# Altium schematic sheet FPGA_XC6SLX9.SchDoc: FPGA XC6SLX9
size A3
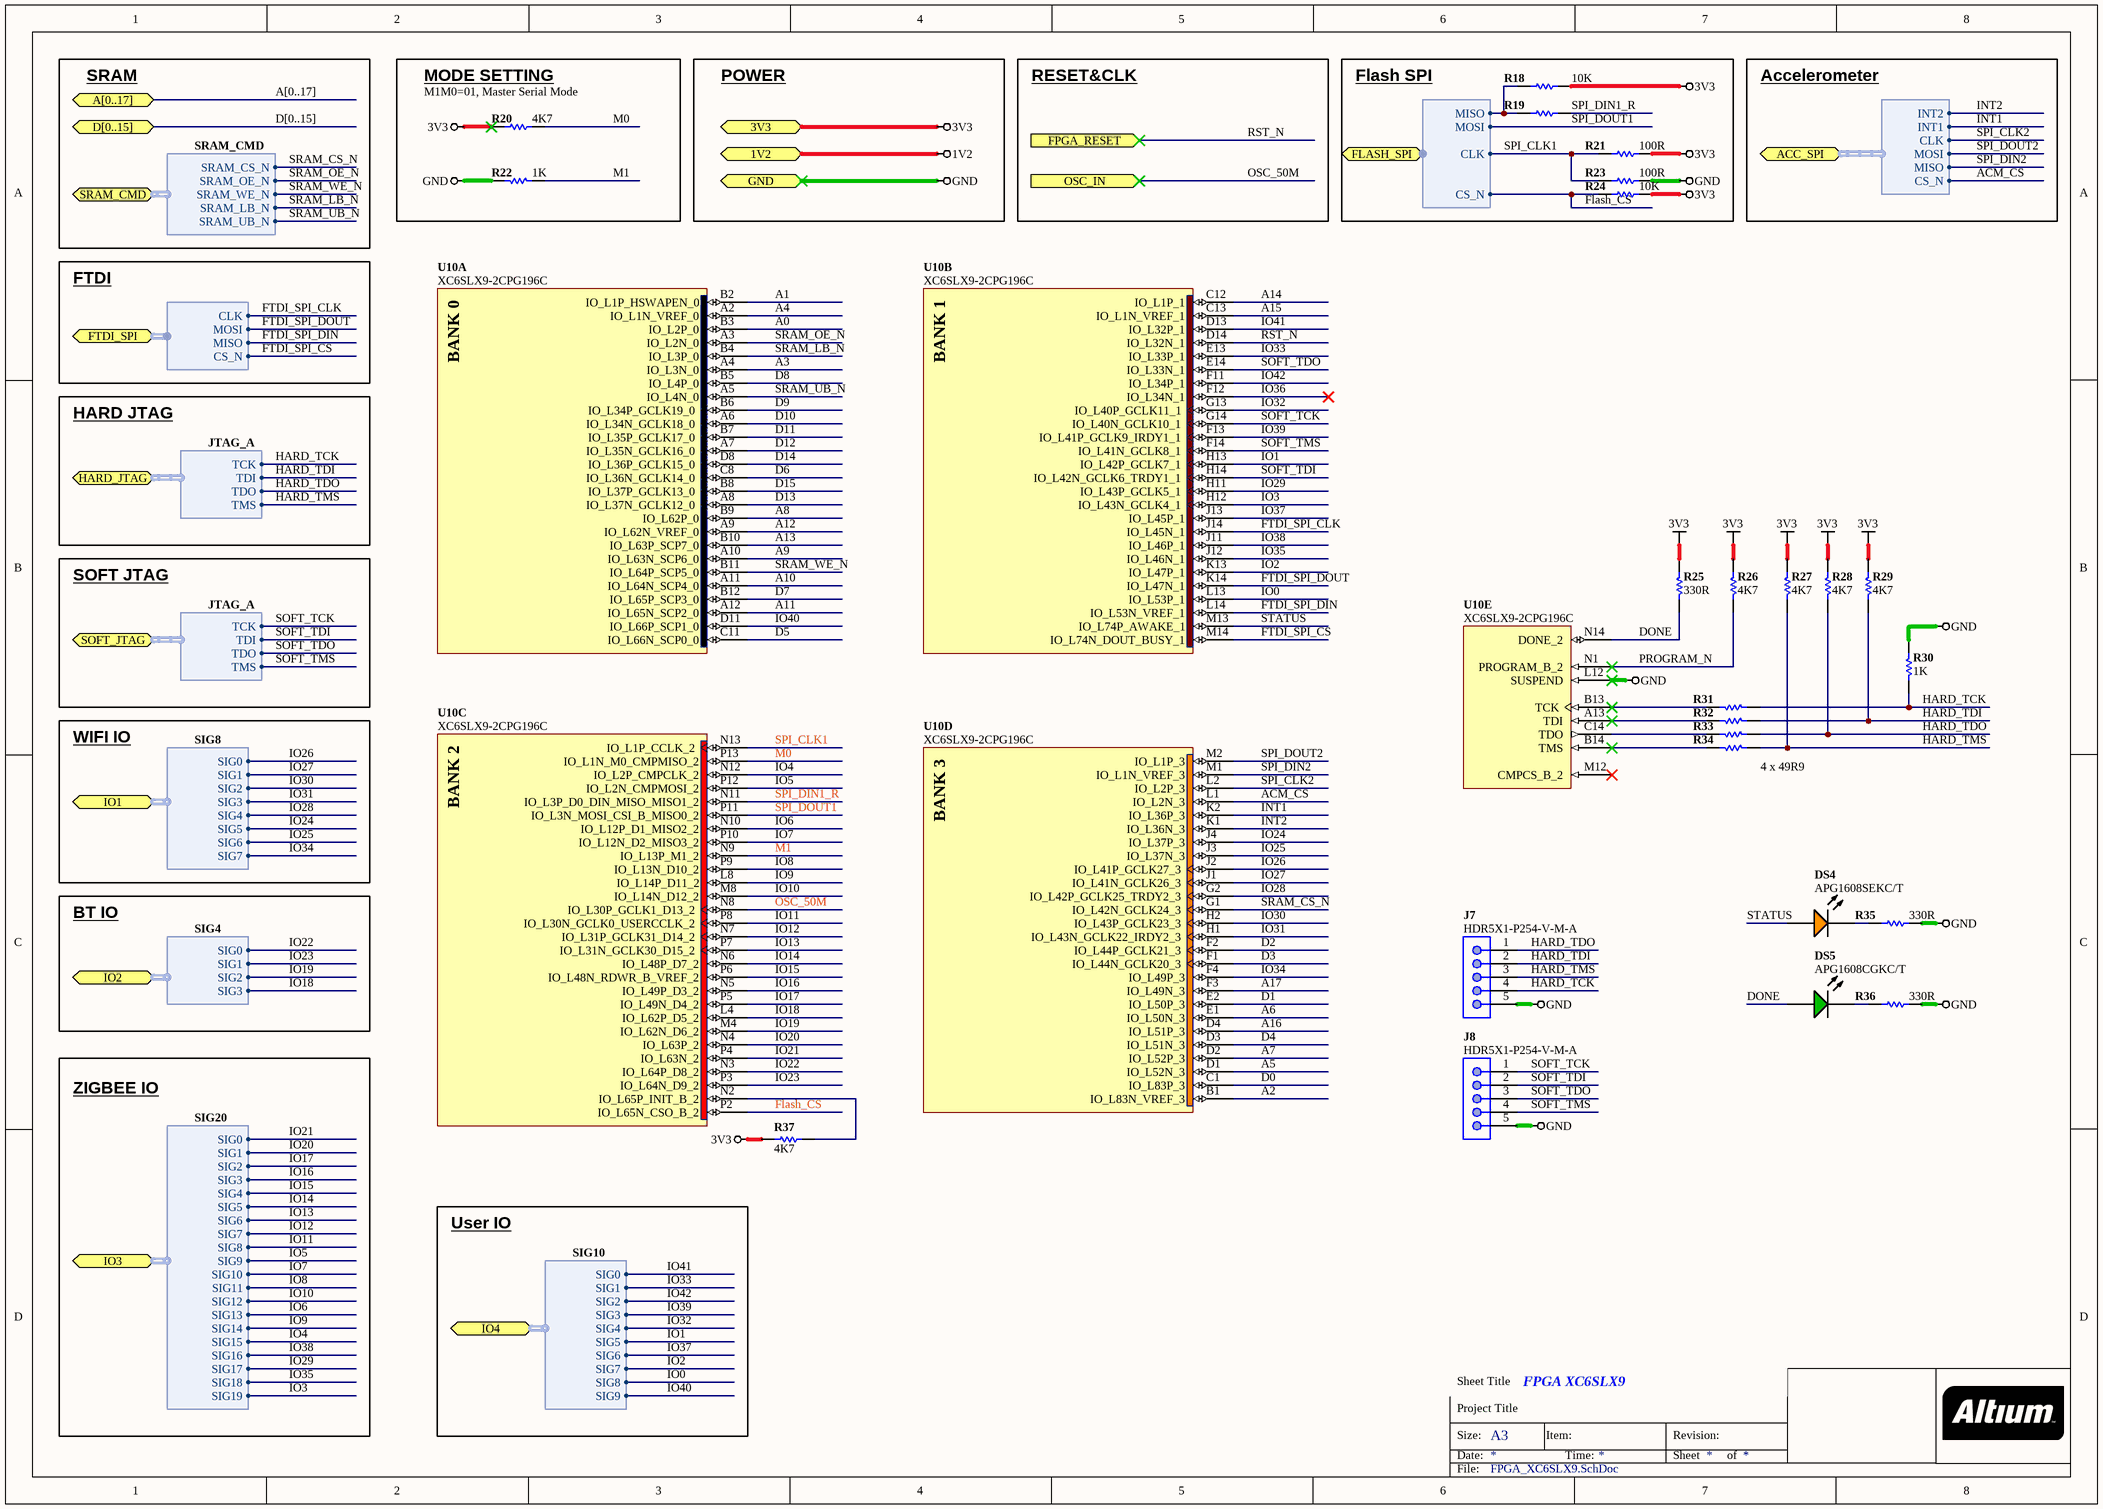
[diagram p0: FPGA_XC6SLX9.SchDoc]

## Parts
DS4  APG1608SEKC/T  [KING-0603(1608)25-Orange]
DS5  APG1608CGKC/T  [KING-0603(1608)25-Green]
J7  HDR5X1-P254-V-M-A  [HDR5X1-P254-V-M-A]
J8  HDR5X1-P254-V-M-A  [HDR5X1-P254-V-M-A]
R18  10K  [RESC0402(1005)_N]
R19  49R9  [RESC0402(1005)_N]  (value not drawn)
R20  4K7  [RESC0402(1005)_N]
R21  100R  [RESC0402(1005)_N]
R22  1K  [RESC0402(1005)_N]
R23  100R  [RESC0402(1005)_N]
R24  10K  [RESC0402(1005)_N]
R25  330R  [RESC0402(1005)_N]
R26  4K7  [RESC0402(1005)_N]
R27  4K7  [RESC0402(1005)_N]
R28  4K7  [RESC0402(1005)_N]
R29  4K7  [RESC0402(1005)_N]
R30  1K  [RESC0402(1005)_N]
R31  49R9  [RESC0402(1005)_N]  (value not drawn)
R32  49R9  [RESC0402(1005)_N]  (value not drawn)
R33  49R9  [RESC0402(1005)_N]  (value not drawn)
R34  49R9  [RESC0402(1005)_N]  (value not drawn)
R35  330R  [RESC0402(1005)_N]
R36  330R  [RESC0402(1005)_N]
R37  4K7  [RESC0402(1005)_N]
U10  XC6SLX9-2CPG196C  [CPG196]  (parts A,B,C,D,E of 7)

## Blocks framed on the sheet
MODE SETTING: R20 R22
Flash SPI: R18 R19 R21 R23 R24

## Ports
1V2, 3V3, A[0..17] (bidir), ACC_SPI (harness ACC_SPI), D[0..15] (bidir), FLASH_SPI (harness FLASH_SPI), FPGA_RESET (in), FTDI_SPI (harness FTDI_SPI), GND, HARD_JTAG (harness JTAG_A), IO1 (harness SIG8), IO2 (harness SIG4), IO3 (harness SIG20), IO4 (harness SIG10), OSC_IN (in), SOFT_JTAG (harness JTAG_A), SRAM_CMD (harness SRAM_CMD)

## Harnesses
SRAM_CMD: SRAM_OE_N, SRAM_WE_N, SRAM_LB_N, SRAM_UB_N, SRAM_CS_N
SIG8: SIG0, SIG1, SIG2, SIG3, SIG4, SIG5, SIG6, SIG7
SIG4: SIG0, SIG1, SIG2, SIG3
SIG20: SIG0, SIG1, SIG2, SIG3, SIG4, SIG5, SIG6, SIG7, SIG8, SIG9, SIG10, SIG11, SIG12, SIG13, SIG14, SIG15, SIG16, SIG17, SIG18, SIG19
JTAG_A: TMS, TDO, TDI, TCK
SIG10: SIG0, SIG1, SIG2, SIG3, SIG4, SIG5, SIG6, SIG7, SIG8, SIG9
FTDI_SPI: CLK, CS_N, MOSI, MISO
ACC_SPI: CLK, CS_N, MOSI, MISO, INT1, INT2
FLASH_SPI: CLK, MOSI, MISO, CS_N

## Nets
1V2: port 1V2
3V3: R18.1 R20.2 R21.2 R24.2 R25.1 R26.2 R27.2 R28.2 R29.2 R37.2 ; port 3V3
GND: J7.5 J8.5 R22.2 R23.1 R30.2 R35.2 R36.2 U10.L12(SUSPEND) ; port GND
A0: U10.B3(IO_L2P_0)
A1: U10.B2(IO_L1P_HSWAPEN_0)
A2: U10.B1(IO_L83N_VREF_3)
A3: U10.A4(IO_L3N_0)
A4: U10.A2(IO_L1N_VREF_0)
A5: U10.D1(IO_L52N_3)
A6: U10.E1(IO_L50N_3)
A7: U10.D2(IO_L52P_3)
A8: U10.B9(IO_L62P_0)
A9: U10.A10(IO_L63N_SCP6_0)
A10: U10.A11(IO_L64N_SCP4_0)
A11: U10.A12(IO_L65N_SCP2_0)
A12: U10.A9(IO_L62N_VREF_0)
A13: U10.B10(IO_L63P_SCP7_0)
A14: U10.C12(IO_L1P_1)
A15: U10.C13(IO_L1N_VREF_1)
A16: U10.D4(IO_L51P_3)
A17: U10.F3(IO_L49N_3)
ACM_CS: U10.L1(IO_L2N_3) ; port ACC_SPI.CS_N
D0: U10.C1(IO_L83P_3)
D1: U10.E2(IO_L50P_3)
D2: U10.F2(IO_L44P_GCLK21_3)
D3: U10.F1(IO_L44N_GCLK20_3)
D4: U10.D3(IO_L51N_3)
D5: U10.C11(IO_L66N_SCP0_0)
D6: U10.C8(IO_L36N_GCLK14_0)
D7: U10.B12(IO_L65P_SCP3_0)
D8: U10.B5(IO_L4P_0)
D9: U10.B6(IO_L34P_GCLK19_0)
D10: U10.A6(IO_L34N_GCLK18_0)
D11: U10.B7(IO_L35P_GCLK17_0)
D12: U10.A7(IO_L35N_GCLK16_0)
D13: U10.A8(IO_L37N_GCLK12_0)
D14: U10.D8(IO_L36P_GCLK15_0)
D15: U10.B8(IO_L37P_GCLK13_0)
DONE: DS5.1(A) R25.2 U10.N14(DONE_2)
Flash_CS: R24.1 U10.P2(IO_L65N_CSO_B_2) ; port FLASH_SPI.CS_N
FTDI_SPI_CLK: U10.J14(IO_L45N_1) ; port FTDI_SPI.CLK
FTDI_SPI_CS: U10.M14(IO_L74N_DOUT_BUSY_1) ; port FTDI_SPI.CS_N
FTDI_SPI_DIN: U10.L14(IO_L53N_VREF_1) ; port FTDI_SPI.MISO
FTDI_SPI_DOUT: U10.K14(IO_L47N_1) ; port FTDI_SPI.MOSI
HARD_TCK: J7.4 R30.1 R31.1 ; port HARD_JTAG.TCK
HARD_TDI: J7.2 R29.1 R32.1 ; port HARD_JTAG.TDI
HARD_TDO: J7.1 R28.1 R33.1 ; port HARD_JTAG.TDO
HARD_TMS: J7.3 R27.1 R34.1 ; port HARD_JTAG.TMS
INT1: U10.K2(IO_L36P_3) ; port ACC_SPI.INT1
INT2: U10.K1(IO_L36N_3) ; port ACC_SPI.INT2
IO0: U10.L13(IO_L53P_1) ; port IO4.SIG8
IO1: U10.H13(IO_L42P_GCLK7_1) ; port IO4.SIG5
IO2: U10.K13(IO_L47P_1) ; port IO4.SIG7
IO3: U10.H12(IO_L43N_GCLK4_1) ; port IO3.SIG19
IO4: U10.N12(IO_L2P_CMPCLK_2) ; port IO3.SIG15
IO5: U10.P12(IO_L2N_CMPMOSI_2) ; port IO3.SIG9
IO6: U10.N10(IO_L12P_D1_MISO2_2) ; port IO3.SIG13
IO7: U10.P10(IO_L12N_D2_MISO3_2) ; port IO3.SIG10
IO8: U10.P9(IO_L13N_D10_2) ; port IO3.SIG11
IO9: U10.L8(IO_L14P_D11_2) ; port IO3.SIG14
IO10: U10.M8(IO_L14N_D12_2) ; port IO3.SIG12
IO11: U10.P8(IO_L30N_GCLK0_USERCCLK_2) ; port IO3.SIG8
IO12: U10.N7(IO_L31P_GCLK31_D14_2) ; port IO3.SIG7
IO13: U10.P7(IO_L31N_GCLK30_D15_2) ; port IO3.SIG6
IO14: U10.N6(IO_L48P_D7_2) ; port IO3.SIG5
IO15: U10.P6(IO_L48N_RDWR_B_VREF_2) ; port IO3.SIG4
IO16: U10.N5(IO_L49P_D3_2) ; port IO3.SIG3
IO17: U10.P5(IO_L49N_D4_2) ; port IO3.SIG2
IO18: U10.L4(IO_L62P_D5_2) ; port IO2.SIG3
IO19: U10.M4(IO_L62N_D6_2) ; port IO2.SIG2
IO20: U10.N4(IO_L63P_2) ; port IO3.SIG1
IO21: U10.P4(IO_L63N_2) ; port IO3.SIG0
IO22: U10.N3(IO_L64P_D8_2) ; port IO2.SIG0
IO23: U10.P3(IO_L64N_D9_2) ; port IO2.SIG1
IO24: U10.J4(IO_L37P_3) ; port IO1.SIG5
IO25: U10.J3(IO_L37N_3) ; port IO1.SIG6
IO26: U10.J2(IO_L41P_GCLK27_3) ; port IO1.SIG0
IO27: U10.J1(IO_L41N_GCLK26_3) ; port IO1.SIG1
IO28: U10.G2(IO_L42P_GCLK25_TRDY2_3) ; port IO1.SIG4
IO29: U10.H11(IO_L43P_GCLK5_1) ; port IO3.SIG17
IO30: U10.H2(IO_L43P_GCLK23_3) ; port IO1.SIG2
IO31: U10.H1(IO_L43N_GCLK22_IRDY2_3) ; port IO1.SIG3
IO32: U10.G13(IO_L40P_GCLK11_1) ; port IO4.SIG4
IO33: U10.E13(IO_L33P_1) ; port IO4.SIG1
IO34: U10.F4(IO_L49P_3) ; port IO1.SIG7
IO35: U10.J12(IO_L46N_1) ; port IO3.SIG18
IO36: U10.F12(IO_L34N_1)
IO37: U10.J13(IO_L45P_1) ; port IO4.SIG6
IO38: U10.J11(IO_L46P_1) ; port IO3.SIG16
IO39: U10.F13(IO_L41P_GCLK9_IRDY1_1) ; port IO4.SIG3
IO40: U10.D11(IO_L66P_SCP1_0) ; port IO4.SIG9
IO41: U10.D13(IO_L32P_1) ; port IO4.SIG0
IO42: U10.F11(IO_L34P_1) ; port IO4.SIG2
M0: R20.1 U10.P13(IO_L1N_M0_CMPMISO_2)
M1: R22.1 U10.N9(IO_L13P_M1_2)
OSC_50M: U10.N8(IO_L30P_GCLK1_D13_2) ; port OSC_IN
PROGRAM_N: R26.1 U10.N1(PROGRAM_B_2)
RST_N: U10.D14(IO_L32N_1) ; port FPGA_RESET
SOFT_TCK: J8.1 U10.G14(IO_L40N_GCLK10_1) ; port SOFT_JTAG.TCK
SOFT_TDI: J8.2 U10.H14(IO_L42N_GCLK6_TRDY1_1) ; port SOFT_JTAG.TDI
SOFT_TDO: J8.3 U10.E14(IO_L33N_1) ; port SOFT_JTAG.TDO
SOFT_TMS: J8.4 U10.F14(IO_L41N_GCLK8_1) ; port SOFT_JTAG.TMS
SPI_CLK1: R21.1 R23.2 U10.N13(IO_L1P_CCLK_2) ; port FLASH_SPI.CLK
SPI_CLK2: U10.L2(IO_L2P_3) ; port ACC_SPI.CLK
SPI_DIN1_R: R19.2 U10.N11(IO_L3P_D0_DIN_MISO_MISO1_2)
SPI_DIN2: U10.M1(IO_L1N_VREF_3) ; port ACC_SPI.MISO
SPI_DOUT1: U10.P11(IO_L3N_MOSI_CSI_B_MISO0_2) ; port FLASH_SPI.MOSI
SPI_DOUT2: U10.M2(IO_L1P_3) ; port ACC_SPI.MOSI
SRAM_CS_N: U10.G1(IO_L42N_GCLK24_3) ; port SRAM_CMD.SRAM_CS_N
SRAM_LB_N: U10.B4(IO_L3P_0) ; port SRAM_CMD.SRAM_LB_N
SRAM_OE_N: U10.A3(IO_L2N_0) ; port SRAM_CMD.SRAM_OE_N
SRAM_UB_N: U10.A5(IO_L4N_0) ; port SRAM_CMD.SRAM_UB_N
SRAM_WE_N: U10.B11(IO_L64P_SCP5_0) ; port SRAM_CMD.SRAM_WE_N
STATUS: DS4.1(A) U10.M13(IO_L74P_AWAKE_1)
NetDS4_2: DS4.2(K) R35.1
NetDS5_2: DS5.2(K) R36.1
NetR18_2: R18.2 R19.1 ; port FLASH_SPI.MISO
NetR31_2: R31.2 U10.B13(TCK)
NetR32_2: R32.2 U10.A13(TDI)
NetR33_2: R33.2 U10.C14(TDO)
NetR34_2: R34.2 U10.B14(TMS)
NetR37_1: R37.1 U10.N2(IO_L65P_INIT_B_2)

Not connected (* = marked no-connect by the designer): U10 M12(CMPCS_B_2)*

## Buses and harness runs
bus A[0..17] = port A[0..17]
bus D[0..15] = port D[0..15]

## Notes on the sheet
- SRAM
- (near R20) M1M0=01, Master Serial Mode
- POWER
- RESET&CLK
- Accelerometer
- FTDI
- HARD JTAG
- SOFT JTAG
- WIFI IO
- (near R34) 4 x 49R9
- BT IO
- ZIGBEE IO
- User IO
- Sheet Title
- Project Title
- Size:
- Date:
- A3
- Item:
- Time:
- Revision:
- Sheet
- of
- File:
- (in symbol CMP-0067-00328-1, part A) BANK 0
- (in symbol CMP-0067-00328-1, part B) BANK 1
- (in symbol CMP-0067-00328-1, part C) BANK 2
- (in symbol CMP-0067-00328-1, part D) BANK 3

## Library data of the parts
DS4 = CMP-5037-00005-1: LED, SMT, 0603(1608), 0.25mm thickness, Super Bright Orange; Power Dissipation: 78 mW; Packing Type: 2000 pcs / reel; Forward Current: 30 mA; Reverse Voltage: 5 V; Class: Optoelectronic; IEC-class: Light emitting diodes; Storage Temperature: -40 to +85 degC; Datasheet: http://www.kingbrightusa.com/images/catalog/SPEC/APG1608SEKC-T.pdf; Sub-class: LED
DS5 = CMP-5037-00004-1: LED, SMT, 0603(1608), 0.25mm thickness, Green; Power Dissipation: 78 mW; Packing Type: 2000 pcs / reel; Forward Current: 30 mA; Reverse Voltage: 5 V; Class: Optoelectronic; IEC-class: Light emitting diodes; Storage Temperature: -40 to +85 degC; Datasheet: http://www.kingbrightusa.com/images/catalog/SPEC/APG1608CGKC-T.pdf; Sub-class: LED
J7 J8 = CMP-5167-00036-1: Male Header IDC, 1 x 5 Pin Vertical 2.54mm Pitch, 5.84mm Mated Height; Class: Board Connector; Component Kind: Standard
R18 = CMP-1011-00098-1: 10K 0.063W 5% 0402 (1005 Metric)  SMD; Case-Metric: 1005; Value: 10000.00 Ohm; Case-EIA: 0402; Technology: SMT; Tolerance: 5 %; Power: 0.063 W
R19 R31-R34 = CMP-1011-00363-1: 49R9 0.063W 1% 0402 (1005 Metric)  SMD; Case-EIA: 0402; Case-Metric: 1005; Value: 49.90 Ohm; Power: 0.063 W; Technology: SMT; Tolerance: 1 %
R20 R26-R29 R37 = CMP-1011-00090-1: 4K7 0.063W 5% 0402 (1005 Metric)  SMD; Value: 4700.00 Ohm; Case-EIA: 0402; Case-Metric: 1005; Tolerance: 5 %; Power: 0.063 W; Technology: SMT
R21 R23 = CMP-1011-00050-1: 100R 0.063W 5% 0402 (1005 Metric)  SMD; Value: 100.00 Ohm; Case-Metric: 1005; Case-EIA: 0402; Power: 0.063 W; Technology: SMT; Tolerance: 5 %
R22 = CMP-1011-00074-1: 1K 0.063W 5% 0402 (1005 Metric)  SMD; Value: 1000.00 Ohm; Case-Metric: 1005; Case-EIA: 0402; Power: 0.063 W; Technology: SMT; Tolerance: 5 %
R24 = CMP-1011-00623-1: 10K 0.063W 1% 0402 (1005 Metric)  SMD; Value: 10000.00 Ohm; Case-Metric: 1005; Case-EIA: 0402; Power: 0.063 W; Technology: SMT; Tolerance: 1 %
R25 R35 R36 = CMP-1011-00062-1: 330R 0.063W 5% 0402 (1005 Metric)  SMD; Case-EIA: 0402; Value: 330.00 Ohm; Case-Metric: 1005; Tolerance: 5 %; Technology: SMT; Power: 0.063 W
R30 = CMP-1011-00074-1: 1K 0.063W 5% 0402 (1005 Metric)  SMD; Value: 1000.00 Ohm; Case-EIA: 0402; Case-Metric: 1005; Tolerance: 5 %; Power: 0.063 W; Technology: SMT
U10 = CMP-0067-00328-1: Spartan-6 LX 1.2V FPGA, 106 User I/Os, 196-Ball Chip-Scale BGA (0.5mm Pitch), Speed Grade 2, Commercial Grade, Pb-Free; Code_JEDEC: MO-275; PackageReference: CPG196; PackageDescription: 196-Ball Chip Scale Ball Grid Array 0.5 mm Pitch (CPG196) - Pb-Free; DatasheetVersion: ver1.6, Nov-2010; PackageVersion: ver1.0, Dec-2009